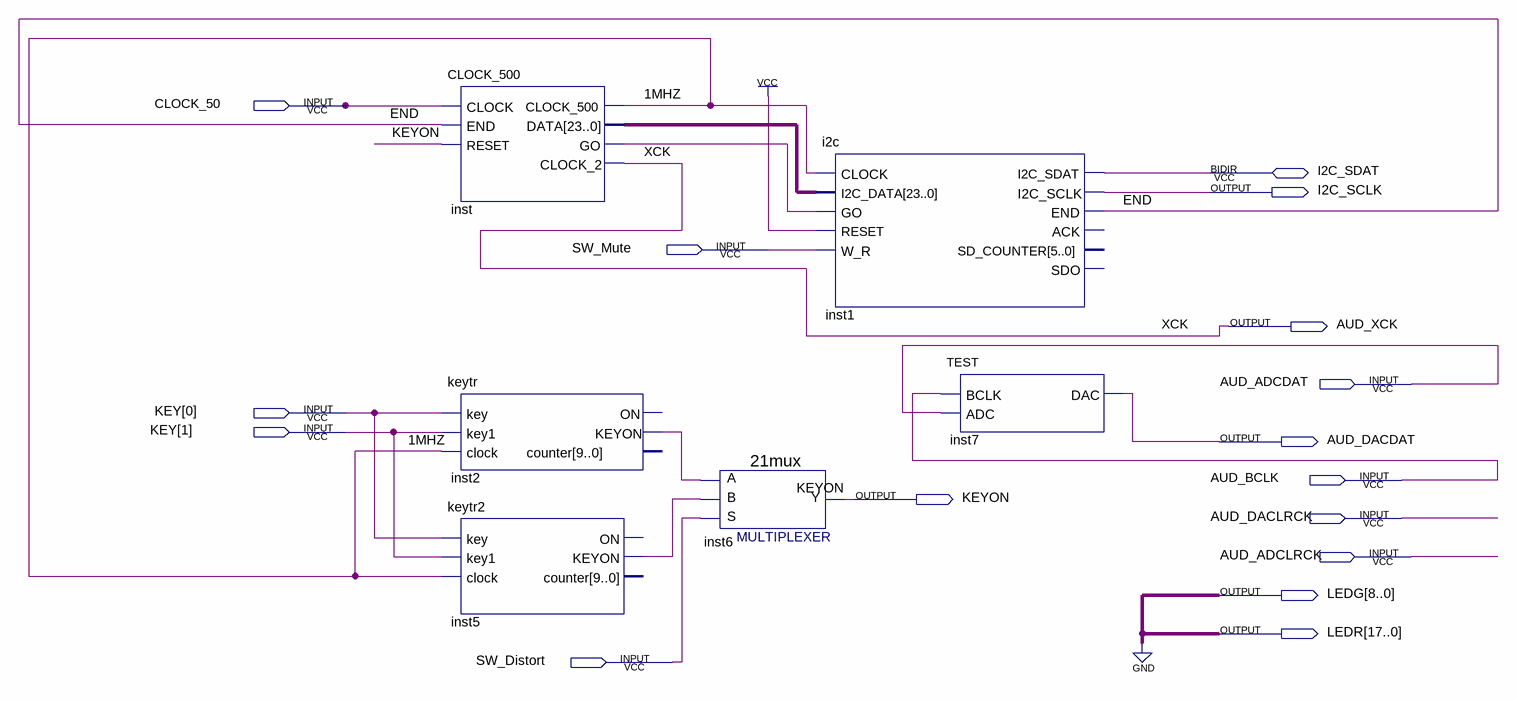
[diagram p0: schematic sheet]
// Quartus schematic DE2_115_i2sound.bdf as structural Verilog: 6 symbols, 16 pins
module DE2_115_i2sound (
  input  CLOCK_50,
  input  SW_Mute,
  input  AUD_ADCDAT,
  input  [1:0] KEY,
  input  AUD_BCLK,
  input  AUD_DACLRCK,
  input  AUD_ADCLRCK,
  input  SW_Distort,
  inout  I2C_SDAT,
  output I2C_SCLK,
  output AUD_XCK,
  output AUD_DACDAT,
  output KEYON,
  output [8:0] LEDG,
  output [17:0] LEDR
);

  wire \1MHZ , END, inst2_keyon, inst5_keyon, inst_go;
  wire [23:0] inst_data;

  CLOCK_500 inst (
    .CLOCK(CLOCK_50), .END(END), .RESET(KEYON), .CLOCK_500(\1MHZ ), .DATA(inst_data), .GO(inst_go),
    .CLOCK_2(AUD_XCK));
  keytr inst2 (.key(KEY[0]), .key1(KEY[1]), .clock(\1MHZ ), .KEYON(inst2_keyon));  // open: ON, counter
  keytr2 inst5 (.key(KEY[0]), .key1(KEY[1]), .clock(\1MHZ ), .KEYON(inst5_keyon));  // open: ON, counter
  \21mux  inst6 (.S(SW_Distort), .B(inst5_keyon), .A(inst2_keyon), .Y(KEYON));
  i2c inst1 (
    .CLOCK(\1MHZ ), .I2C_DATA(inst_data), .GO(inst_go), .RESET(1'b1), .W_R(SW_Mute), .I2C_SCLK(I2C_SCLK),
    .END(END), .I2C_SDAT(I2C_SDAT));  // open: ACK, SD_COUNTER, SDO
  TEST inst7 (.BCLK(AUD_BCLK), .ADC(AUD_ADCDAT), .DAC(AUD_DACDAT));

  assign LEDR = {18{1'b0}};

  // Other names for the same wires on the sheet: XCK = AUD_XCK
endmodule
